# Altium schematic sheet input.SchDoc
size A4
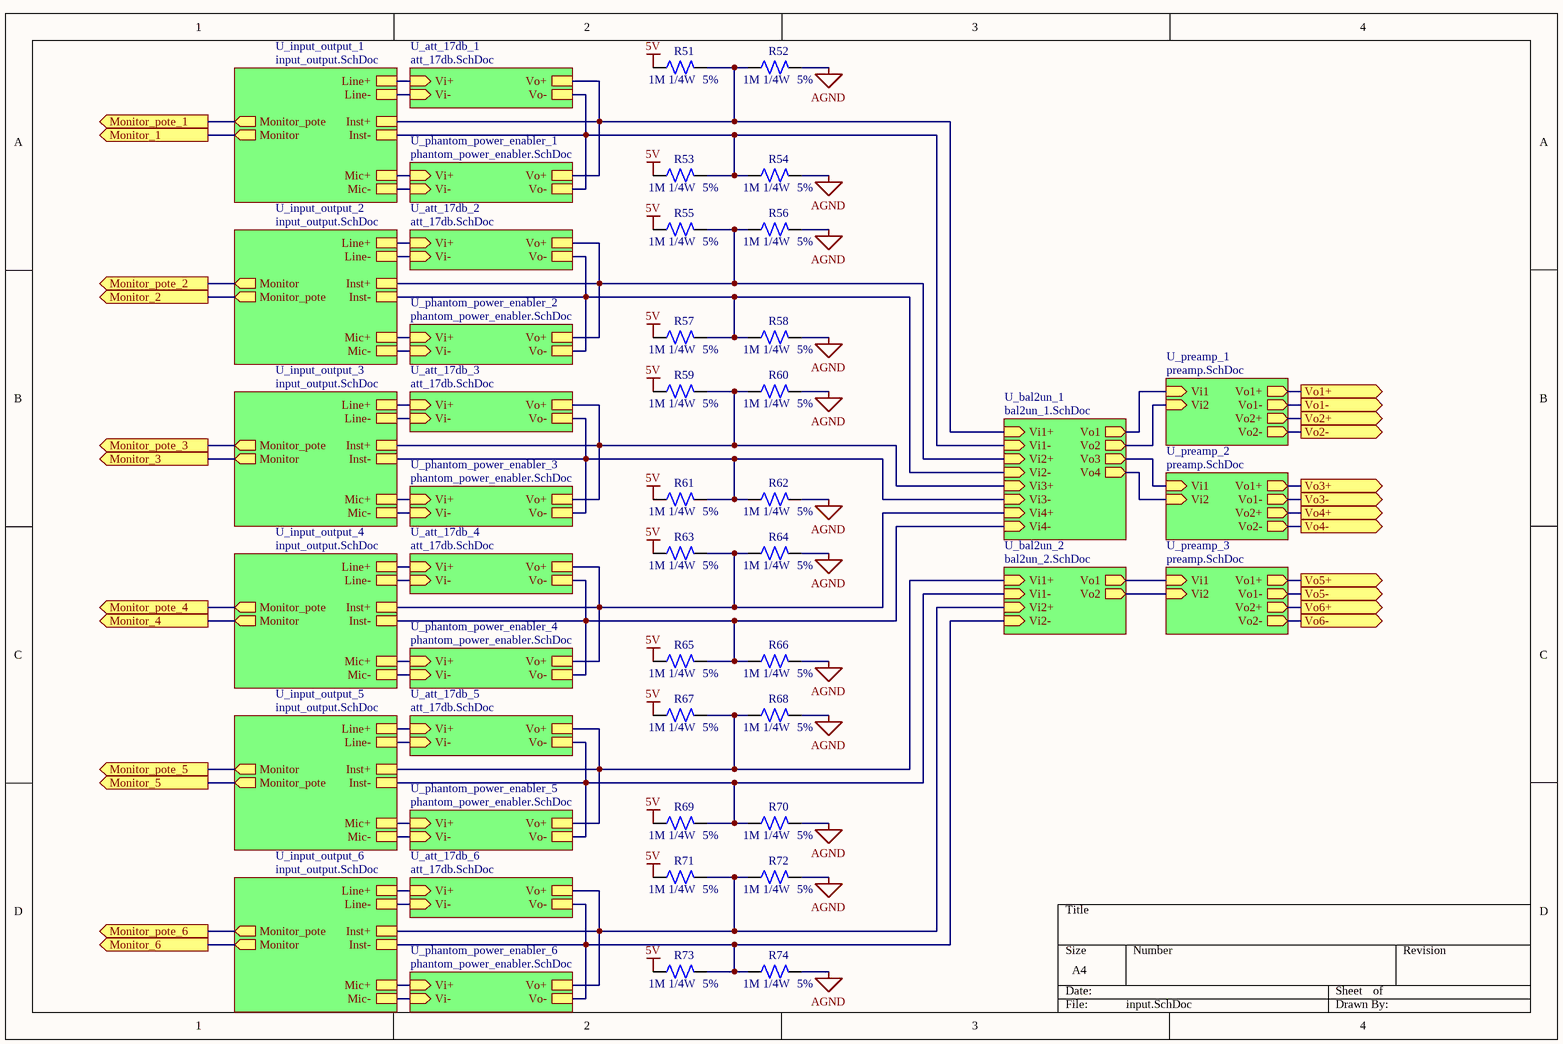
[diagram p0: input.SchDoc]

## Parts
R51  Valor: 1M  Potencia: 1/4W  Tolerancia: 5%  [R0805]  (hidden comment: Resistor)
R52  Valor: 1M  Potencia: 1/4W  Tolerancia: 5%  [R0805]  (hidden comment: Resistor)
R53  Valor: 1M  Potencia: 1/4W  Tolerancia: 5%  [R0805]  (hidden comment: Resistor)
R54  Valor: 1M  Potencia: 1/4W  Tolerancia: 5%  [R0805]  (hidden comment: Resistor)
R55  Valor: 1M  Potencia: 1/4W  Tolerancia: 5%  [R0805]  (hidden comment: Resistor)
R56  Valor: 1M  Potencia: 1/4W  Tolerancia: 5%  [R0805]  (hidden comment: Resistor)
R57  Valor: 1M  Potencia: 1/4W  Tolerancia: 5%  [R0805]  (hidden comment: Resistor)
R58  Valor: 1M  Potencia: 1/4W  Tolerancia: 5%  [R0805]  (hidden comment: Resistor)
R59  Valor: 1M  Potencia: 1/4W  Tolerancia: 5%  [R0805]  (hidden comment: Resistor)
R60  Valor: 1M  Potencia: 1/4W  Tolerancia: 5%  [R0805]  (hidden comment: Resistor)
R61  Valor: 1M  Potencia: 1/4W  Tolerancia: 5%  [R0805]  (hidden comment: Resistor)
R62  Valor: 1M  Potencia: 1/4W  Tolerancia: 5%  [R0805]  (hidden comment: Resistor)
R63  Valor: 1M  Potencia: 1/4W  Tolerancia: 5%  [R0805]  (hidden comment: Resistor)
R64  Valor: 1M  Potencia: 1/4W  Tolerancia: 5%  [R0805]  (hidden comment: Resistor)
R65  Valor: 1M  Potencia: 1/4W  Tolerancia: 5%  [R0805]  (hidden comment: Resistor)
R66  Valor: 1M  Potencia: 1/4W  Tolerancia: 5%  [R0805]  (hidden comment: Resistor)
R67  Valor: 1M  Potencia: 1/4W  Tolerancia: 5%  [R0805]  (hidden comment: Resistor)
R68  Valor: 1M  Potencia: 1/4W  Tolerancia: 5%  [R0805]  (hidden comment: Resistor)
R69  Valor: 1M  Potencia: 1/4W  Tolerancia: 5%  [R0805]  (hidden comment: Resistor)
R70  Valor: 1M  Potencia: 1/4W  Tolerancia: 5%  [R0805]  (hidden comment: Resistor)
R71  Valor: 1M  Potencia: 1/4W  Tolerancia: 5%  [R0805]  (hidden comment: Resistor)
R72  Valor: 1M  Potencia: 1/4W  Tolerancia: 5%  [R0805]  (hidden comment: Resistor)
R73  Valor: 1M  Potencia: 1/4W  Tolerancia: 5%  [R0805]  (hidden comment: Resistor)
R74  Valor: 1M  Potencia: 1/4W  Tolerancia: 5%  [R0805]  (hidden comment: Resistor)

## Sub-sheets
U_att_17db_1 = att_17db.SchDoc: Vi+ (in), Vi- (in), Vo-, Vo+
U_att_17db_2 = att_17db.SchDoc: Vi+ (in), Vi- (in), Vo-, Vo+
U_att_17db_3 = att_17db.SchDoc: Vi+ (in), Vi- (in), Vo-, Vo+
U_att_17db_4 = att_17db.SchDoc: Vi+ (in), Vi- (in), Vo-, Vo+
U_att_17db_5 = att_17db.SchDoc: Vi+ (in), Vi- (in), Vo-, Vo+
U_att_17db_6 = att_17db.SchDoc: Vi+ (in), Vi- (in), Vo-, Vo+
U_bal2un_1 = bal2un_1.SchDoc: Vi2+ (in), Vi2- (in), Vo2 (out), Vi3+ (in), Vi3- (in), Vo1 (out), Vi4+ (in), Vi4- (in), Vo3 (out), Vi1+ (in), Vi1- (in), Vo4 (out)
U_bal2un_2 = bal2un_2.SchDoc: Vi2+ (in), Vi2- (in), Vo2 (out), Vi1+ (in), Vi1- (in), Vo1 (out)
U_input_output_1 = input_output.SchDoc: Mic-, Inst-, Mic+, Line-, Line+, Inst+, Monitor_pote (out), Monitor (out)
U_input_output_2 = input_output.SchDoc: Mic-, Inst-, Mic+, Line-, Line+, Inst+, Monitor (out), Monitor_pote (out)
U_input_output_3 = input_output.SchDoc: Mic-, Inst-, Mic+, Line-, Line+, Inst+, Monitor_pote (out), Monitor (out)
U_input_output_4 = input_output.SchDoc: Mic-, Inst-, Mic+, Line-, Line+, Inst+, Monitor_pote (out), Monitor (out)
U_input_output_5 = input_output.SchDoc: Mic-, Inst-, Mic+, Line-, Line+, Inst+, Monitor (out), Monitor_pote (out)
U_input_output_6 = input_output.SchDoc: Mic-, Inst-, Mic+, Line-, Line+, Inst+, Monitor_pote (out), Monitor (out)
U_phantom_power_enabler_1 = phantom_power_enabler.SchDoc: Vi+ (in), Vi- (in), Vo+, Vo-
U_phantom_power_enabler_2 = phantom_power_enabler.SchDoc: Vi+ (in), Vi- (in), Vo+, Vo-
U_phantom_power_enabler_3 = phantom_power_enabler.SchDoc: Vi+ (in), Vi- (in), Vo+, Vo-
U_phantom_power_enabler_4 = phantom_power_enabler.SchDoc: Vi+ (in), Vi- (in), Vo+, Vo-
U_phantom_power_enabler_5 = phantom_power_enabler.SchDoc: Vi+ (in), Vi- (in), Vo+, Vo-
U_phantom_power_enabler_6 = phantom_power_enabler.SchDoc: Vi+ (in), Vi- (in), Vo+, Vo-
U_preamp_1 = preamp.SchDoc: Vi2 (in), Vi1 (in), Vo1+ (out), Vo2- (out), Vo2+ (out), Vo1- (out)
U_preamp_2 = preamp.SchDoc: Vi2 (in), Vi1 (in), Vo1+ (out), Vo2- (out), Vo2+ (out), Vo1- (out)
U_preamp_3 = preamp.SchDoc: Vi2 (in), Vi1 (in), Vo1+ (out), Vo2- (out), Vo2+ (out), Vo1- (out)

## Ports
Monitor_1 (out), Monitor_2 (out), Monitor_3 (out), Monitor_4 (out), Monitor_5 (out), Monitor_6 (out), Monitor_pote_1 (out), Monitor_pote_2 (out), Monitor_pote_3 (out), Monitor_pote_4 (out), Monitor_pote_5 (out), Monitor_pote_6 (out), Vo1+ (out), Vo1- (out), Vo2+ (out), Vo2- (out), Vo3+ (out), Vo3- (out), Vo4+ (out), Vo4- (out), Vo5+ (out), Vo5- (out), Vo6+ (out), Vo6- (out)

## Nets
5V: R51.1 R53.1 R55.1 R57.1 R59.1 R61.1 R63.1 R65.1 R67.1 R69.1 R71.1 R73.1
AGND: R52.2 R54.2 R56.2 R58.2 R60.2 R62.2 R64.2 R66.2 R68.2 R70.2 R72.2 R74.2
Monitor_1: port Monitor_1, sheet U_input_output_1/Monitor
Monitor_2: port Monitor_2, sheet U_input_output_2/Monitor_pote
Monitor_3: port Monitor_3, sheet U_input_output_3/Monitor
Monitor_4: port Monitor_4, sheet U_input_output_4/Monitor
Monitor_5: port Monitor_5, sheet U_input_output_5/Monitor_pote
Monitor_6: port Monitor_6, sheet U_input_output_6/Monitor
Monitor_pote_1: port Monitor_pote_1, sheet U_input_output_1/Monitor_pote
Monitor_pote_2: port Monitor_pote_2, sheet U_input_output_2/Monitor
Monitor_pote_3: port Monitor_pote_3, sheet U_input_output_3/Monitor_pote
Monitor_pote_4: port Monitor_pote_4, sheet U_input_output_4/Monitor_pote
Monitor_pote_5: port Monitor_pote_5, sheet U_input_output_5/Monitor
Monitor_pote_6: port Monitor_pote_6, sheet U_input_output_6/Monitor_pote
Vo1+: port Vo1+, sheet U_preamp_1/Vo1+
Vo1-: port Vo1-, sheet U_preamp_1/Vo1-
Vo2+: port Vo2+, sheet U_preamp_1/Vo2+
Vo2-: port Vo2-, sheet U_preamp_1/Vo2-
Vo3+: port Vo3+, sheet U_preamp_2/Vo1+
Vo3-: port Vo3-, sheet U_preamp_2/Vo1-
Vo4+: port Vo4+, sheet U_preamp_2/Vo2+
Vo4-: port Vo4-, sheet U_preamp_2/Vo2-
Vo5+: port Vo5+, sheet U_preamp_3/Vo1+
Vo5-: port Vo5-, sheet U_preamp_3/Vo1-
Vo6+: port Vo6+, sheet U_preamp_3/Vo2+
Vo6-: port Vo6-, sheet U_preamp_3/Vo2-
NetR51_2: R51.2 R52.1 ; sheet U_input_output_1/Inst+, sheet U_att_17db_1/Vo+, sheet U_bal2un_1/Vi1+, sheet U_phantom_power_enabler_1/Vo+
NetR53_2: R53.2 R54.1 ; sheet U_input_output_1/Inst-, sheet U_att_17db_1/Vo-, sheet U_bal2un_1/Vi1-, sheet U_phantom_power_enabler_1/Vo-
NetR55_2: R55.2 R56.1 ; sheet U_bal2un_1/Vi2+, sheet U_input_output_2/Inst+, sheet U_att_17db_2/Vo+, sheet U_phantom_power_enabler_2/Vo+
NetR57_2: R57.2 R58.1 ; sheet U_bal2un_1/Vi2-, sheet U_input_output_2/Inst-, sheet U_att_17db_2/Vo-, sheet U_phantom_power_enabler_2/Vo-
NetR59_2: R59.2 R60.1 ; sheet U_bal2un_1/Vi3+, sheet U_input_output_3/Inst+, sheet U_att_17db_3/Vo+, sheet U_phantom_power_enabler_3/Vo+
NetR61_2: R61.2 R62.1 ; sheet U_bal2un_1/Vi3-, sheet U_input_output_3/Inst-, sheet U_att_17db_3/Vo-, sheet U_phantom_power_enabler_3/Vo-
NetR63_2: R63.2 R64.1 ; sheet U_bal2un_1/Vi4+, sheet U_input_output_4/Inst+, sheet U_att_17db_4/Vo+, sheet U_phantom_power_enabler_4/Vo+
NetR65_2: R65.2 R66.1 ; sheet U_bal2un_1/Vi4-, sheet U_input_output_4/Inst-, sheet U_att_17db_4/Vo-, sheet U_phantom_power_enabler_4/Vo-
NetR67_2: R67.2 R68.1 ; sheet U_bal2un_2/Vi1+, sheet U_input_output_5/Inst+, sheet U_att_17db_5/Vo+, sheet U_phantom_power_enabler_5/Vo+
NetR69_2: R69.2 R70.1 ; sheet U_bal2un_2/Vi1-, sheet U_input_output_5/Inst-, sheet U_att_17db_5/Vo-, sheet U_phantom_power_enabler_5/Vo-
NetR71_2: R71.2 R72.1 ; sheet U_bal2un_2/Vi2+, sheet U_input_output_6/Inst+, sheet U_att_17db_6/Vo+, sheet U_phantom_power_enabler_6/Vo+
NetR73_2: R73.2 R74.1 ; sheet U_bal2un_2/Vi2-, sheet U_input_output_6/Inst-, sheet U_att_17db_6/Vo-, sheet U_phantom_power_enabler_6/Vo-
(unnamed): sheet U_input_output_1/Mic-, sheet U_phantom_power_enabler_1/Vi-
(unnamed): sheet U_input_output_1/Mic+, sheet U_phantom_power_enabler_1/Vi+
(unnamed): sheet U_input_output_1/Line-, sheet U_att_17db_1/Vi-
(unnamed): sheet U_input_output_1/Line+, sheet U_att_17db_1/Vi+
(unnamed): sheet U_preamp_1/Vi2, sheet U_bal2un_1/Vo2
(unnamed): sheet U_preamp_1/Vi1, sheet U_bal2un_1/Vo1
(unnamed): sheet U_preamp_2/Vi2, sheet U_bal2un_1/Vo4
(unnamed): sheet U_preamp_2/Vi1, sheet U_bal2un_1/Vo3
(unnamed): sheet U_bal2un_2/Vo2, sheet U_preamp_3/Vi2
(unnamed): sheet U_bal2un_2/Vo1, sheet U_preamp_3/Vi1
(unnamed): sheet U_input_output_2/Mic-, sheet U_phantom_power_enabler_2/Vi-
(unnamed): sheet U_input_output_2/Mic+, sheet U_phantom_power_enabler_2/Vi+
(unnamed): sheet U_input_output_2/Line-, sheet U_att_17db_2/Vi-
(unnamed): sheet U_input_output_2/Line+, sheet U_att_17db_2/Vi+
(unnamed): sheet U_input_output_3/Mic-, sheet U_phantom_power_enabler_3/Vi-
(unnamed): sheet U_input_output_3/Mic+, sheet U_phantom_power_enabler_3/Vi+
(unnamed): sheet U_input_output_3/Line-, sheet U_att_17db_3/Vi-
(unnamed): sheet U_input_output_3/Line+, sheet U_att_17db_3/Vi+
(unnamed): sheet U_input_output_4/Mic-, sheet U_phantom_power_enabler_4/Vi-
(unnamed): sheet U_input_output_4/Mic+, sheet U_phantom_power_enabler_4/Vi+
(unnamed): sheet U_input_output_4/Line-, sheet U_att_17db_4/Vi-
(unnamed): sheet U_input_output_4/Line+, sheet U_att_17db_4/Vi+
(unnamed): sheet U_input_output_5/Mic-, sheet U_phantom_power_enabler_5/Vi-
(unnamed): sheet U_input_output_5/Mic+, sheet U_phantom_power_enabler_5/Vi+
(unnamed): sheet U_input_output_5/Line-, sheet U_att_17db_5/Vi-
(unnamed): sheet U_input_output_5/Line+, sheet U_att_17db_5/Vi+
(unnamed): sheet U_input_output_6/Mic-, sheet U_phantom_power_enabler_6/Vi-
(unnamed): sheet U_input_output_6/Mic+, sheet U_phantom_power_enabler_6/Vi+
(unnamed): sheet U_input_output_6/Line-, sheet U_att_17db_6/Vi-
(unnamed): sheet U_input_output_6/Line+, sheet U_att_17db_6/Vi+

## Library data of the parts
R51-R74 = Resistor: Resistencia